# Altium schematic sheet Main.SchDoc
size A4; SheetNumber: 1; SheetTotal: 4
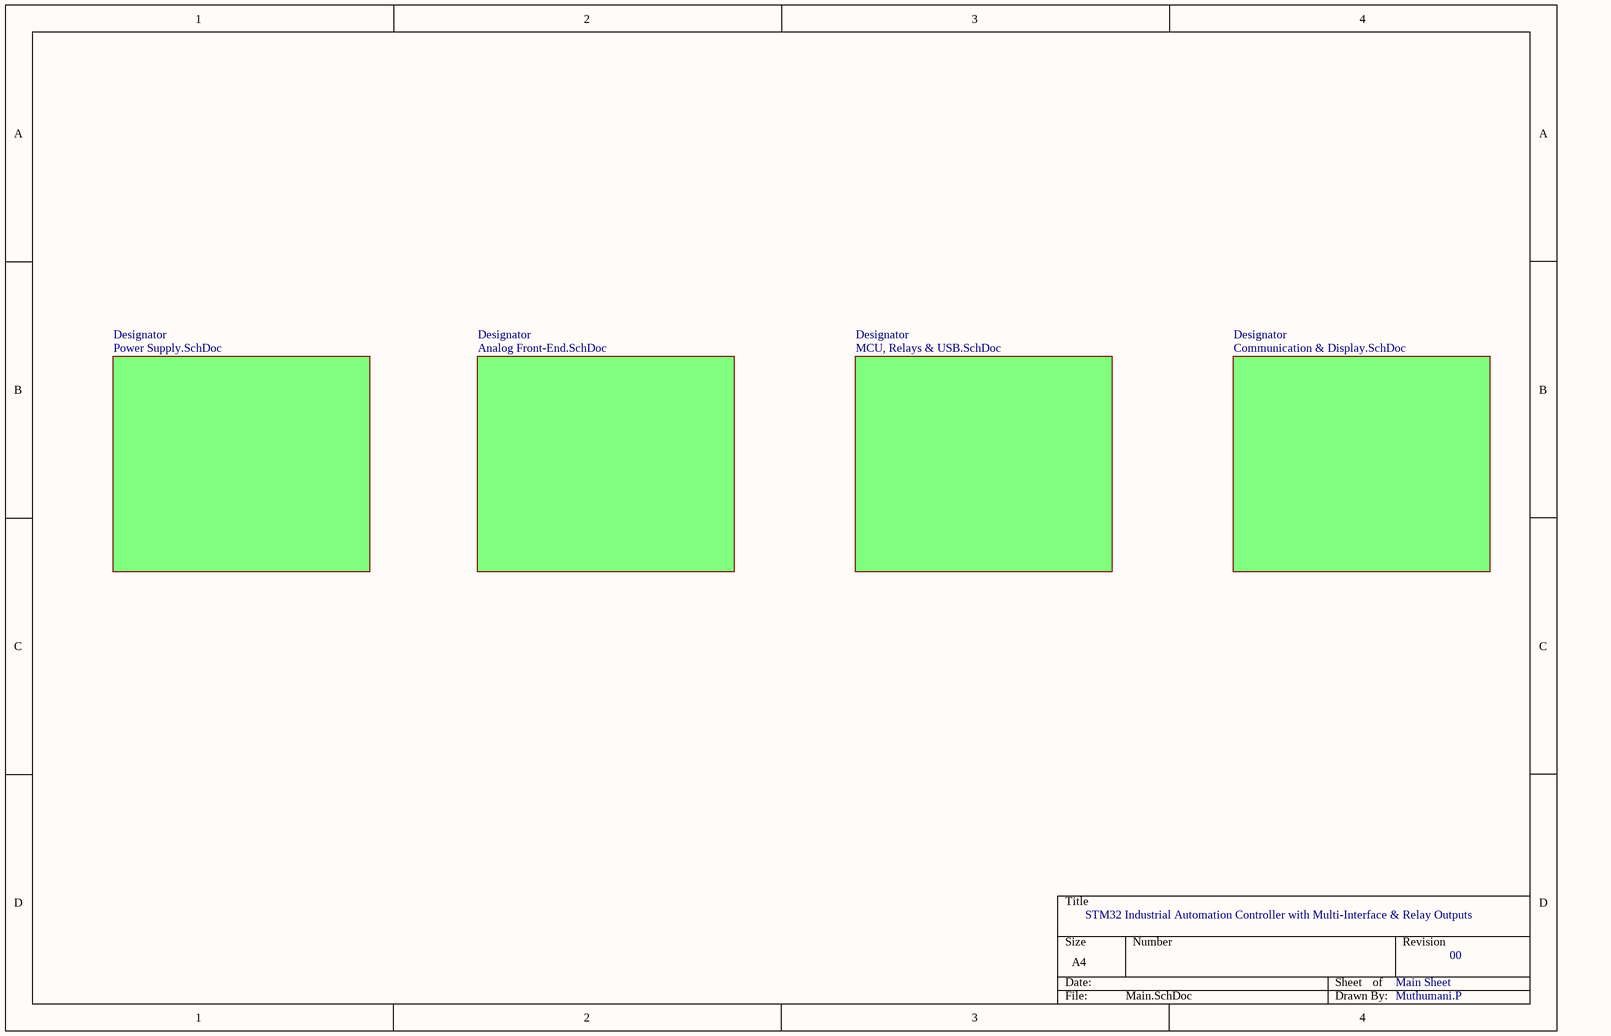
[diagram p0: Main.SchDoc]

## Sub-sheets
Designator = Power Supply.SchDoc: no entries
Designator = Analog Front-End.SchDoc: no entries
Designator = MCU, Relays & USB.SchDoc: no entries
Designator = Communication & Display.SchDoc: no entries

## Notes on the sheet
- STM32 Industrial Automation Controller with Multi-Interface & Relay Outputs
- Main Sheet
- 00
- Muthumani.P